# EAGLE schematic Scrum Marquee (EAGLE 7.2.0)
Marquee Project
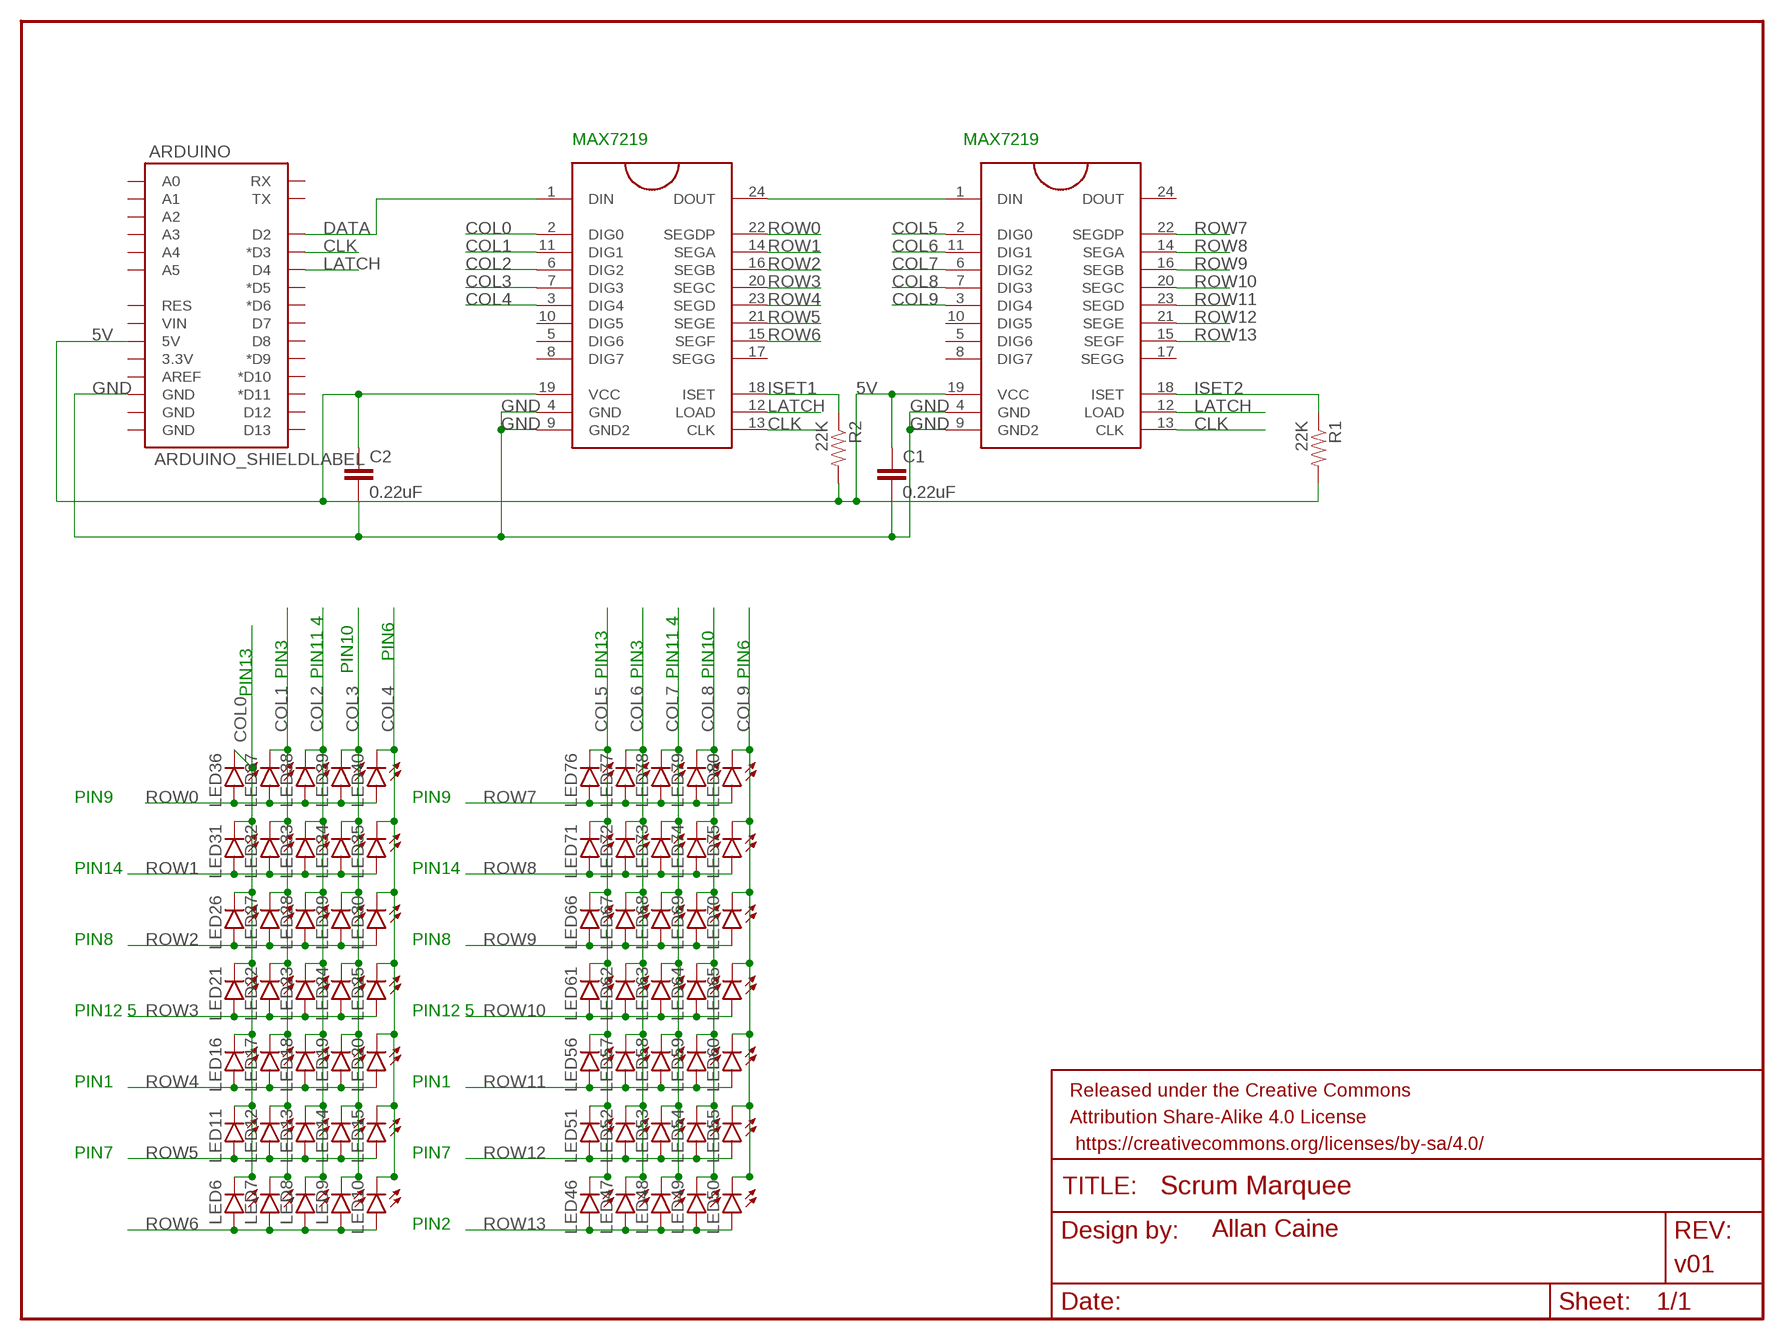
[diagram p0: schematic, sheet 1]

## Parts
ARDUINO  ARDUINO_SHIELDLABEL  [DUEMILANOVE_SHIELD]
C1  0.22uF  0.1UF-50V-20%(PTH)KIT-EZ  [CAP-PTH-SMALL-KIT]
C2  0.22uF  0.1UF-50V-20%(PTH)KIT-EZ  [CAP-PTH-SMALL-KIT]
FRAME1  FRAME-LETTER  [CREATIVE_COMMONS]
LED6  LED5MM  [LED5MM]
LED7  LED5MM  [LED5MM]
LED8  LED5MM  [LED5MM]
LED9  LED5MM  [LED5MM]
LED10  LED5MM  [LED5MM]
LED11  LED5MM  [LED5MM]
LED12  LED5MM  [LED5MM]
LED13  LED5MM  [LED5MM]
LED14  LED5MM  [LED5MM]
LED15  LED5MM  [LED5MM]
LED16  LED5MM  [LED5MM]
LED17  LED5MM  [LED5MM]
LED18  LED5MM  [LED5MM]
LED19  LED5MM  [LED5MM]
LED20  LED5MM  [LED5MM]
LED21  LED5MM  [LED5MM]
LED22  LED5MM  [LED5MM]
LED23  LED5MM  [LED5MM]
LED24  LED5MM  [LED5MM]
LED25  LED5MM  [LED5MM]
LED26  LED5MM  [LED5MM]
LED27  LED5MM  [LED5MM]
LED28  LED5MM  [LED5MM]
LED29  LED5MM  [LED5MM]
LED30  LED5MM  [LED5MM]
LED31  LED5MM  [LED5MM]
LED32  LED5MM  [LED5MM]
LED33  LED5MM  [LED5MM]
LED34  LED5MM  [LED5MM]
LED35  LED5MM  [LED5MM]
LED36  LED5MM  [LED5MM]
LED37  LED5MM  [LED5MM]
LED38  LED5MM  [LED5MM]
LED39  LED5MM  [LED5MM]
LED40  LED5MM  [LED5MM]
LED46  LED5MM  [LED5MM]
LED47  LED5MM  [LED5MM]
LED48  LED5MM  [LED5MM]
LED49  LED5MM  [LED5MM]
LED50  LED5MM  [LED5MM]
LED51  LED5MM  [LED5MM]
LED52  LED5MM  [LED5MM]
LED53  LED5MM  [LED5MM]
LED54  LED5MM  [LED5MM]
LED55  LED5MM  [LED5MM]
LED56  LED5MM  [LED5MM]
LED57  LED5MM  [LED5MM]
LED58  LED5MM  [LED5MM]
LED59  LED5MM  [LED5MM]
LED60  LED5MM  [LED5MM]
LED61  LED5MM  [LED5MM]
LED62  LED5MM  [LED5MM]
LED63  LED5MM  [LED5MM]
LED64  LED5MM  [LED5MM]
LED65  LED5MM  [LED5MM]
LED66  LED5MM  [LED5MM]
LED67  LED5MM  [LED5MM]
LED68  LED5MM  [LED5MM]
LED69  LED5MM  [LED5MM]
LED70  LED5MM  [LED5MM]
LED71  LED5MM  [LED5MM]
LED72  LED5MM  [LED5MM]
LED73  LED5MM  [LED5MM]
LED74  LED5MM  [LED5MM]
LED75  LED5MM  [LED5MM]
LED76  LED5MM  [LED5MM]
LED77  LED5MM  [LED5MM]
LED78  LED5MM  [LED5MM]
LED79  LED5MM  [LED5MM]
LED80  LED5MM  [LED5MM]
MAX7219DIP  MAX7219DIP  [DIL24]
R1  22K  RESISTORPTH-1/4W  [AXIAL-0.4]
R2  22K  RESISTORPTH-1/4W  [AXIAL-0.4]
U$2  MAX7219DIP  [DIL24]

## Nets
5V: ARDUINO.5V C1.1 C2.1 MAX7219DIP.19(VCC) R1.P$2 R2.P$2 U$2.19(VCC)
CLK: ARDUINO.D3(*D3) MAX7219DIP.13(CLK) U$2.13(CLK)
COL0: LED6.K(C) LED11.K(C) LED16.K(C) LED21.K(C) LED26.K(C) LED31.K(C) LED36.K(C) MAX7219DIP.2(DIG0)
COL1: LED7.K(C) LED12.K(C) LED17.K(C) LED22.K(C) LED27.K(C) LED32.K(C) LED37.K(C) MAX7219DIP.11(DIG1)
COL2: LED8.K(C) LED13.K(C) LED18.K(C) LED23.K(C) LED28.K(C) LED33.K(C) LED38.K(C) MAX7219DIP.6(DIG2)
COL3: LED9.K(C) LED14.K(C) LED19.K(C) LED24.K(C) LED29.K(C) LED34.K(C) LED39.K(C) MAX7219DIP.7(DIG3)
COL4: LED10.K(C) LED15.K(C) LED20.K(C) LED25.K(C) LED30.K(C) LED35.K(C) LED40.K(C) MAX7219DIP.3(DIG4)
COL5: LED46.K(C) LED51.K(C) LED56.K(C) LED61.K(C) LED66.K(C) LED71.K(C) LED76.K(C) U$2.2(DIG0)
COL6: LED47.K(C) LED52.K(C) LED57.K(C) LED62.K(C) LED67.K(C) LED72.K(C) LED77.K(C) U$2.11(DIG1)
COL7: LED48.K(C) LED53.K(C) LED58.K(C) LED63.K(C) LED68.K(C) LED73.K(C) LED78.K(C) U$2.6(DIG2)
COL8: LED49.K(C) LED54.K(C) LED59.K(C) LED64.K(C) LED69.K(C) LED74.K(C) LED79.K(C) U$2.7(DIG3)
COL9: LED50.K(C) LED55.K(C) LED60.K(C) LED65.K(C) LED70.K(C) LED75.K(C) LED80.K(C) U$2.3(DIG4)
DATA: ARDUINO.D2 MAX7219DIP.1(DIN)
GND: ARDUINO.GND@2(GND) C1.2 C2.2 MAX7219DIP.4(GND) MAX7219DIP.9(GND2) U$2.4(GND) U$2.9(GND2)
ISET1: MAX7219DIP.18(ISET) R2.P$1
ISET2: R1.P$1 U$2.18(ISET)
LATCH: ARDUINO.D4 MAX7219DIP.12(LOAD) U$2.12(LOAD)
N$3: MAX7219DIP.24(DOUT) U$2.1(DIN)
ROW0: LED36.A LED37.A LED38.A LED39.A LED40.A MAX7219DIP.22(SEGDP)
ROW1: LED31.A LED32.A LED33.A LED34.A LED35.A MAX7219DIP.14(SEGA)
ROW2: LED26.A LED27.A LED28.A LED29.A LED30.A MAX7219DIP.16(SEGB)
ROW3: LED21.A LED22.A LED23.A LED24.A LED25.A MAX7219DIP.20(SEGC)
ROW4: LED16.A LED17.A LED18.A LED19.A LED20.A MAX7219DIP.23(SEGD)
ROW5: LED11.A LED12.A LED13.A LED14.A LED15.A MAX7219DIP.21(SEGE)
ROW6: LED6.A LED7.A LED8.A LED9.A LED10.A MAX7219DIP.15(SEGF)
ROW7: LED76.A LED77.A LED78.A LED79.A LED80.A U$2.22(SEGDP)
ROW8: LED71.A LED72.A LED73.A LED74.A LED75.A U$2.14(SEGA)
ROW9: LED66.A LED67.A LED68.A LED69.A LED70.A U$2.16(SEGB)
ROW10: LED61.A LED62.A LED63.A LED64.A LED65.A U$2.20(SEGC)
ROW11: LED56.A LED57.A LED58.A LED59.A LED60.A U$2.23(SEGD)
ROW12: LED51.A LED52.A LED53.A LED54.A LED55.A U$2.21(SEGE)
ROW13: LED46.A LED47.A LED48.A LED49.A LED50.A U$2.15(SEGF)
Unconnected: ARDUINO.3.3V ARDUINO.A0 ARDUINO.A1 ARDUINO.A2 ARDUINO.A3 ARDUINO.A4 ARDUINO.A5 ARDUINO.AREF ARDUINO.D5(*D5) ARDUINO.D6(*D6) ARDUINO.D7 ARDUINO.D8 ARDUINO.D9(*D9) ARDUINO.D10(*D10) ARDUINO.D11(*D11) ARDUINO.D12 ARDUINO.D13 ARDUINO.GND@0(GND) ARDUINO.GND@1(GND) ARDUINO.RES ARDUINO.RX ARDUINO.TX ARDUINO.VIN MAX7219DIP.5(DIG6) MAX7219DIP.8(DIG7) MAX7219DIP.10(DIG5) MAX7219DIP.17(SEGG) U$2.5(DIG6) U$2.8(DIG7) U$2.10(DIG5) U$2.17(SEGG) U$2.24(DOUT)

## Notes on the sheet
- MAX7219 | MAX7219
- PIN10
- PIN6
- PIN3 | PIN11 4 | PIN13 | PIN3 | PIN11 4 | PIN10 | PIN6
- PIN13
- PIN9 | PIN9
- PIN14 | PIN14
- PIN8 | PIN8
- PIN12 5 | PIN12 5
- PIN1 | PIN1
- PIN7 | PIN7
- PIN2

## Library data of the parts
ARDUINO = SparkFun-Boards:ARDUINO_SHIELD: Arduino shield footprint
C1 C2 = SparkFun-Capacitors:0.1UF-50V-20%(PTH): CAP-08370; PROD_ID: CAP-08370
FRAME1 = SparkFun-Aesthetics:FRAME-LETTER: Schematic Frame Standard 8.5x11 US Letter frame; DESIGNER: Allan Caine; VERSION: v01
LED6-LED40 LED46-LED80 = SparkFun-LED:LED: LEDs Standard schematic elements and footprints for 5mm, 3mm, 1206, and 0603 sized LEDs. 5mm - Spark Fun Electronics SKU : COM-00529 (and others)
MAX7219DIP U$2 = SparkFun-DigitalIC:MAX7219: 8-digit, 8-segment LED display driver, serial input
R1 R2 = SparkFun-Passives:RESISTOR: Resistor Basic schematic elements and footprints for 0603, 1206, and PTH resistors.